# Altium schematic sheet DSO_IO.SchDoc: Schematic_Name
size A4; CompanyName: University of Melbourne; Engineer: Your Name Here; DocumentNumber: 1; Revision: 0.1; SheetNumber: 1; SheetTotal: 1; Title_Project: Project_Title; StudentNo: Student No.
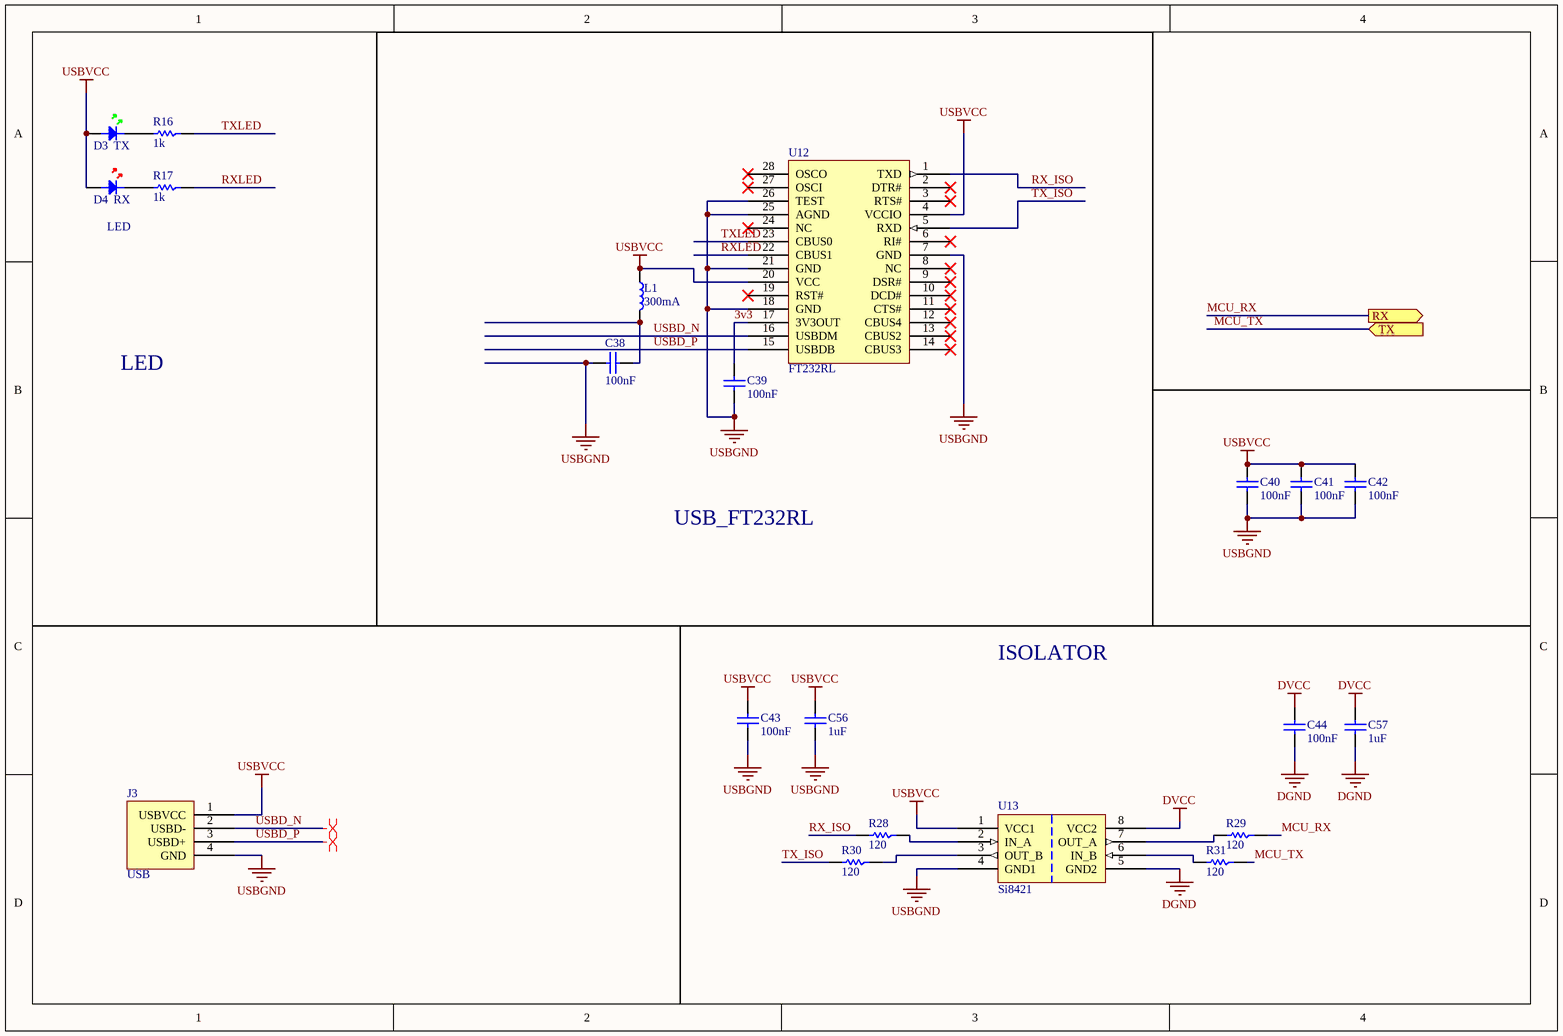
[diagram p0: DSO_IO.SchDoc]

## Parts
C38  100nF  [0805C]
C39  100nF  [0805C]
C40  100nF  [0805C]
C41  100nF  [0805C]
C42  100nF  [0805C]
C43  100nF  [0805C]
C44  100nF  [0805C]
C56  1uF  [0805C]
C57  1uF  [0805C]
D3  TX  [0805D-GREEN]
D4  RX  [0805D-RED]
J3  USB  [USBPLUG]
L1  300mA  [0805]
R16  1k  [0805]
R17  1k  [0805]
R28  120  [0805]
R29  120  [0805]
R30  120  [0805]
R31  120  [0805]
U12  FT232RL  [SSOP-28]
U13  Si8421  [SOIC-8]

## Ports
RX (out), TX (in)

## Nets
DGND: C44.2 C57.2 U13.5(GND2)
DVCC: C44.1 C57.1 U13.8(VCC2)
USBGND: C38.2 C39.2 C40.2 C41.2 C42.2 C43.2 C56.2 J3.4(GND) U12.7(GND) U12.18(GND) U12.21(GND) U12.25(AGND) U12.26(TEST) U13.4(GND1)
USBVCC: C40.1 C41.1 C42.1 C43.1 C56.1 D3.A D4.A J3.1(USBVCC) L1.1 U12.4(VCCIO) U12.20(VCC) U13.1(VCC1)
3v3: C39.1 U12.17(3V3OUT)
MCU_RX: R29.1 ; port RX
MCU_TX: R31.1 ; port TX
RX_ISO: R28.2 U12.1(TXD)
RXLED: R17.1 U12.22(CBUS1)
TX_ISO: R30.2 U12.5(RXD)
TXLED: R16.1 U12.23(CBUS0)
USBD_N: J3.2(USBD-) U12.16(USBDM)
USBD_P: J3.3(USBD+) U12.15(USBDB)
NetC38_1: C38.1 L1.2
NetD3_K: D3.K R16.2
NetD4_K: D4.K R17.2
NetR28_1: R28.1 U13.2(IN_A)
NetR29_2: R29.2 U13.7(OUT_A)
NetR30_1: R30.1 U13.3(OUT_B)
NetR31_2: R31.2 U13.6(IN_B)

Not connected (* = marked no-connect by the designer): U12 2(DTR#)* 3(RTS#)* 6(RI#)* 8(NC)* 9(DSR#)* 10(DCD#)* 11(CTS#)* 12(CBUS4)* 13(CBUS2)* 14(CBUS3)* 19(RST#)* 24(NC)* 27(OSCI)* 28(OSCO)*

## Layout directives
differential pair: USBD_N, USBD_P

## Notes on the sheet
- LED
- USB_FT232RL
- ISOLATOR

## Library data of the parts
C38-C44 C56 C57 = C: Capacitor; Reviewed by: RM - 2018/08/05; Revision: July-2002: Re-released for DXP Platform.; Supplier 1: *; Supplier Part Number 1: *
  C38-C44: Value: 100nF
  C56 C57: Value: 1uF
D3 = LED GREEN: Light Emitting Diode; Reviewed by: RM - 2018/08/05; Revision: July-2002: Re-released for DXP Platform.; Supplier 1: Digi-Key; Supplier Part Number 1: 160-1423-1-ND
D4 = LED RED: Light Emitting Diode; Reviewed by: RM - 2018/08/05; Revision: July-2002: Re-released for DXP Platform.; Supplier 1: Digi-Key; Supplier Part Number 1: 475-1415-1-ND
J3 = USBPLUG: USB B Type Connector; Reviewed by: RM - 2018/08/05; Supplier 1: Digi-Key; Supplier Part Number 1: 609-1039-ND
L1 = I: Inductor; Reviewed by: RM - 2018/08/05; Value: 300mA; Supplier 1: *; Supplier Part Number 1: *
R16 R17 R28-R31 = R: Resistor; Reviewed by: RM - 2018/08/05; Supplier 1: *; Suppler Part Number 1: *
  R16 R17: Value: 1k
  R28-R31: Value: 120
U12 = FT232RL: USB to Serial bridge; Reviewed by: RM - 2018/08/05; Supplier 1: Digi-Key; Supplier Part Number 1: 768-1007-1-ND
U13 = Si8421: Dual Channel Digital Isolator Both Ways; Reviewed by: RM - 2018/08/05; Supplier 1: Digi-Key; Supplier Part Number 1: 336-1755-5-ND